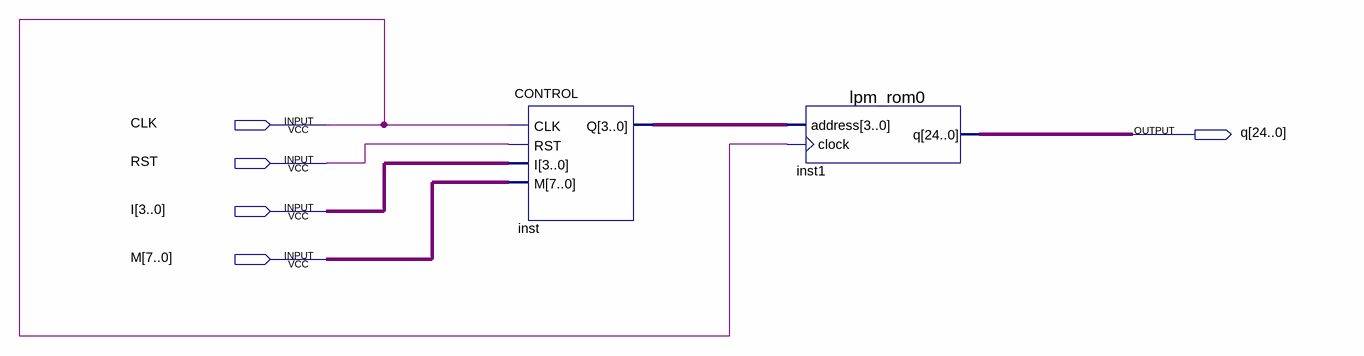
[diagram p0: schematic sheet]
// Quartus schematic CONTROLBLOCK.bdf as structural Verilog: 2 symbols, 5 pins
module CONTROLBLOCK (
  input  CLK,
  input  RST,
  input  [3:0] I,
  input  [7:0] M,
  output [24:0] q
);

  wire [3:0] inst_q;

  CONTROL inst (.CLK(CLK), .RST(RST), .I(I), .M(M), .Q(inst_q));
  lpm_rom0 inst1 (.address(inst_q), .clock(CLK), .q(q));
endmodule
